# Altium schematic sheet DEV Board.SchDoc
size A3
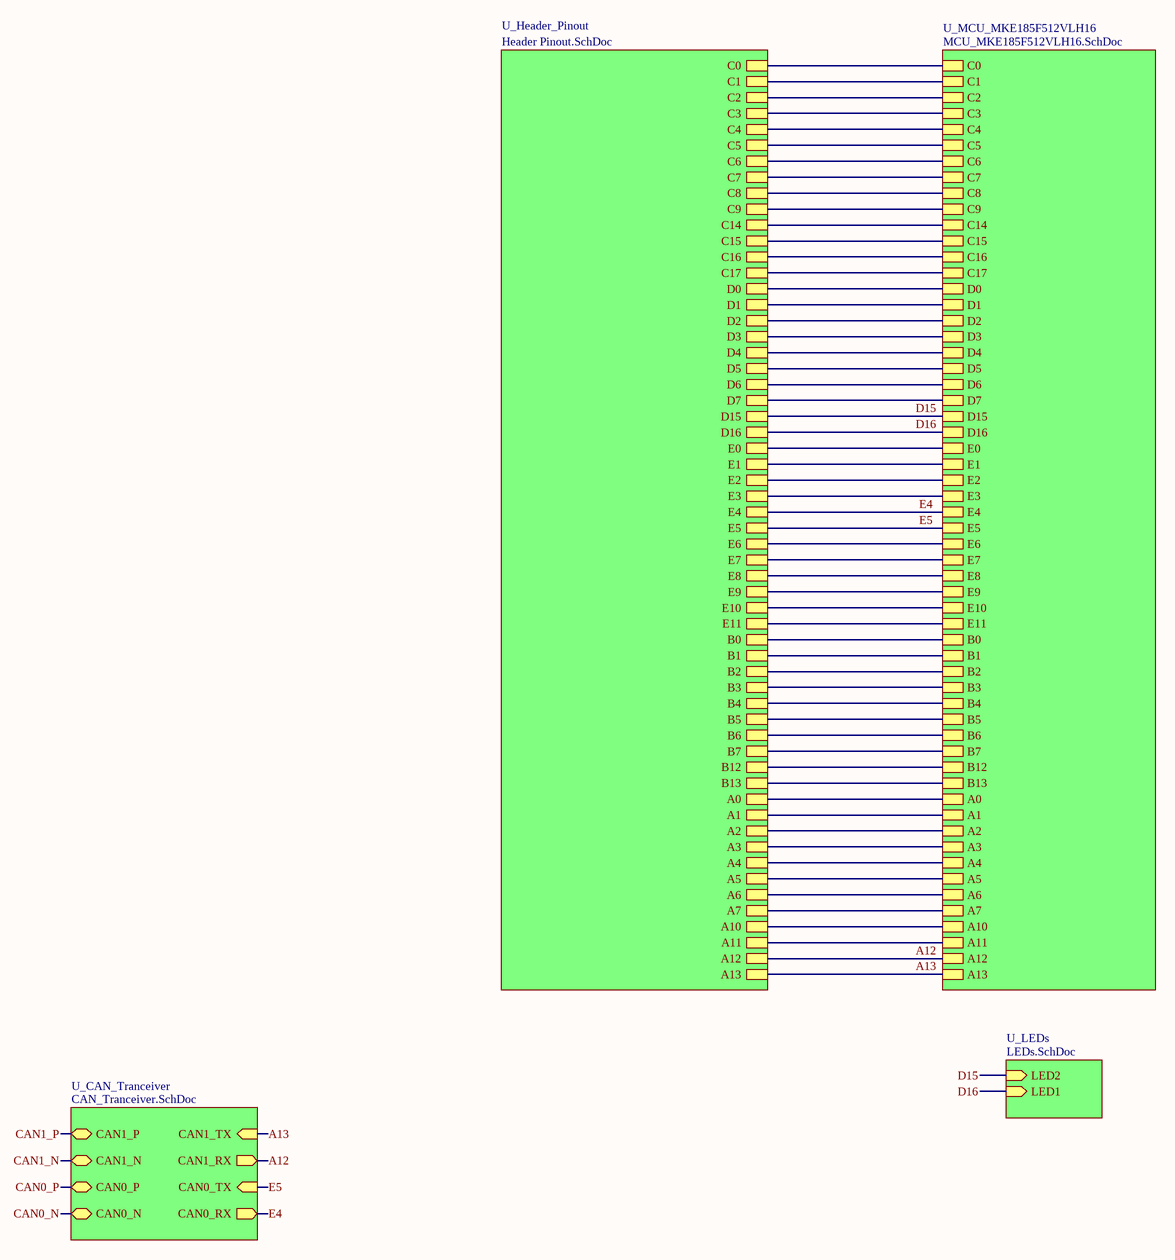
[diagram p0: DEV Board.SchDoc]

## Sub-sheets
U_CAN_Tranceiver = CAN_Tranceiver.SchDoc: CAN1_RX (out), CAN1_TX (in), CAN1_P (bidir), CAN1_N (bidir), CAN0_RX (out), CAN0_TX (in), CAN0_P (bidir), CAN0_N (bidir)
U_Header_Pinout = Header Pinout.SchDoc: A13, A12, A11, A10, A7, A6, A5, A4, A3, A2, A1, A0, B13, B12, B7, B6, B5, B4, B3, B2, B1, B0, E11, E10, E9, E8, E7, E6, E5, E4, E3, E2, E1, E0, D16, D15, D7, D6, D5, D4, D3, D2, D1, D0, C17, C16, C15, C14, C9, C8, C7, C6, C5, C4, C3, C2, C1, C0
U_LEDs = LEDs.SchDoc: LED2 (in), LED1 (in)
U_MCU_MKE185F512VLH16 = MCU_MKE185F512VLH16.SchDoc: C0, C1, C2, C3, C6, C7, C8, C9, C14, C15, C16, C17, C4, C5, D0, D1, D2, D3, D4, D5, D6, D7, D15, D16, E0, E1, E2, E3, E4, E5, E6, E7, E8, E9, E10, E11, B0, B1, B2, B3, B4, B5, B6, B7, B12, B13, A4, A5, A10, A0, A1, A2, A3, A6, A7, A11, A12, A13

## Nets
A12: sheet U_CAN_Tranceiver/CAN1_RX, sheet U_MCU_MKE185F512VLH16/A12, sheet U_Header_Pinout/A12
A13: sheet U_CAN_Tranceiver/CAN1_TX, sheet U_MCU_MKE185F512VLH16/A13, sheet U_Header_Pinout/A13
CAN0_N: sheet U_CAN_Tranceiver/CAN0_N
CAN0_P: sheet U_CAN_Tranceiver/CAN0_P
CAN1_N: sheet U_CAN_Tranceiver/CAN1_N
CAN1_P: sheet U_CAN_Tranceiver/CAN1_P
D15: sheet U_LEDs/LED2, sheet U_MCU_MKE185F512VLH16/D15, sheet U_Header_Pinout/D15
D16: sheet U_LEDs/LED1, sheet U_MCU_MKE185F512VLH16/D16, sheet U_Header_Pinout/D16
E4: sheet U_CAN_Tranceiver/CAN0_RX, sheet U_MCU_MKE185F512VLH16/E4, sheet U_Header_Pinout/E4
E5: sheet U_CAN_Tranceiver/CAN0_TX, sheet U_MCU_MKE185F512VLH16/E5, sheet U_Header_Pinout/E5
(unnamed): sheet U_MCU_MKE185F512VLH16/C0, sheet U_Header_Pinout/C0
(unnamed): sheet U_MCU_MKE185F512VLH16/C1, sheet U_Header_Pinout/C1
(unnamed): sheet U_MCU_MKE185F512VLH16/C2, sheet U_Header_Pinout/C2
(unnamed): sheet U_MCU_MKE185F512VLH16/C3, sheet U_Header_Pinout/C3
(unnamed): sheet U_MCU_MKE185F512VLH16/C6, sheet U_Header_Pinout/C6
(unnamed): sheet U_MCU_MKE185F512VLH16/C7, sheet U_Header_Pinout/C7
(unnamed): sheet U_MCU_MKE185F512VLH16/C8, sheet U_Header_Pinout/C8
(unnamed): sheet U_MCU_MKE185F512VLH16/C9, sheet U_Header_Pinout/C9
(unnamed): sheet U_MCU_MKE185F512VLH16/C14, sheet U_Header_Pinout/C14
(unnamed): sheet U_MCU_MKE185F512VLH16/C15, sheet U_Header_Pinout/C15
(unnamed): sheet U_MCU_MKE185F512VLH16/C16, sheet U_Header_Pinout/C16
(unnamed): sheet U_MCU_MKE185F512VLH16/C17, sheet U_Header_Pinout/C17
(unnamed): sheet U_MCU_MKE185F512VLH16/C4, sheet U_Header_Pinout/C4
(unnamed): sheet U_MCU_MKE185F512VLH16/C5, sheet U_Header_Pinout/C5
(unnamed): sheet U_MCU_MKE185F512VLH16/D0, sheet U_Header_Pinout/D0
(unnamed): sheet U_MCU_MKE185F512VLH16/D1, sheet U_Header_Pinout/D1
(unnamed): sheet U_MCU_MKE185F512VLH16/D2, sheet U_Header_Pinout/D2
(unnamed): sheet U_MCU_MKE185F512VLH16/D3, sheet U_Header_Pinout/D3
(unnamed): sheet U_MCU_MKE185F512VLH16/D4, sheet U_Header_Pinout/D4
(unnamed): sheet U_MCU_MKE185F512VLH16/D5, sheet U_Header_Pinout/D5
(unnamed): sheet U_MCU_MKE185F512VLH16/D6, sheet U_Header_Pinout/D6
(unnamed): sheet U_MCU_MKE185F512VLH16/D7, sheet U_Header_Pinout/D7
(unnamed): sheet U_MCU_MKE185F512VLH16/E0, sheet U_Header_Pinout/E0
(unnamed): sheet U_MCU_MKE185F512VLH16/E1, sheet U_Header_Pinout/E1
(unnamed): sheet U_MCU_MKE185F512VLH16/E2, sheet U_Header_Pinout/E2
(unnamed): sheet U_MCU_MKE185F512VLH16/E3, sheet U_Header_Pinout/E3
(unnamed): sheet U_MCU_MKE185F512VLH16/E6, sheet U_Header_Pinout/E6
(unnamed): sheet U_MCU_MKE185F512VLH16/E7, sheet U_Header_Pinout/E7
(unnamed): sheet U_MCU_MKE185F512VLH16/E8, sheet U_Header_Pinout/E8
(unnamed): sheet U_MCU_MKE185F512VLH16/E9, sheet U_Header_Pinout/E9
(unnamed): sheet U_MCU_MKE185F512VLH16/E10, sheet U_Header_Pinout/E10
(unnamed): sheet U_MCU_MKE185F512VLH16/E11, sheet U_Header_Pinout/E11
(unnamed): sheet U_MCU_MKE185F512VLH16/B0, sheet U_Header_Pinout/B0
(unnamed): sheet U_MCU_MKE185F512VLH16/B1, sheet U_Header_Pinout/B1
(unnamed): sheet U_MCU_MKE185F512VLH16/B2, sheet U_Header_Pinout/B2
(unnamed): sheet U_MCU_MKE185F512VLH16/B3, sheet U_Header_Pinout/B3
(unnamed): sheet U_MCU_MKE185F512VLH16/B4, sheet U_Header_Pinout/B4
(unnamed): sheet U_MCU_MKE185F512VLH16/B5, sheet U_Header_Pinout/B5
(unnamed): sheet U_MCU_MKE185F512VLH16/B6, sheet U_Header_Pinout/B6
(unnamed): sheet U_MCU_MKE185F512VLH16/B7, sheet U_Header_Pinout/B7
(unnamed): sheet U_MCU_MKE185F512VLH16/B12, sheet U_Header_Pinout/B12
(unnamed): sheet U_MCU_MKE185F512VLH16/B13, sheet U_Header_Pinout/B13
(unnamed): sheet U_MCU_MKE185F512VLH16/A4, sheet U_Header_Pinout/A4
(unnamed): sheet U_MCU_MKE185F512VLH16/A5, sheet U_Header_Pinout/A5
(unnamed): sheet U_MCU_MKE185F512VLH16/A10, sheet U_Header_Pinout/A10
(unnamed): sheet U_MCU_MKE185F512VLH16/A0, sheet U_Header_Pinout/A0
(unnamed): sheet U_MCU_MKE185F512VLH16/A1, sheet U_Header_Pinout/A1
(unnamed): sheet U_MCU_MKE185F512VLH16/A2, sheet U_Header_Pinout/A2
(unnamed): sheet U_MCU_MKE185F512VLH16/A3, sheet U_Header_Pinout/A3
(unnamed): sheet U_MCU_MKE185F512VLH16/A6, sheet U_Header_Pinout/A6
(unnamed): sheet U_MCU_MKE185F512VLH16/A7, sheet U_Header_Pinout/A7
(unnamed): sheet U_MCU_MKE185F512VLH16/A11, sheet U_Header_Pinout/A11